# Altium schematic sheet Chargers.SchDoc
size A4
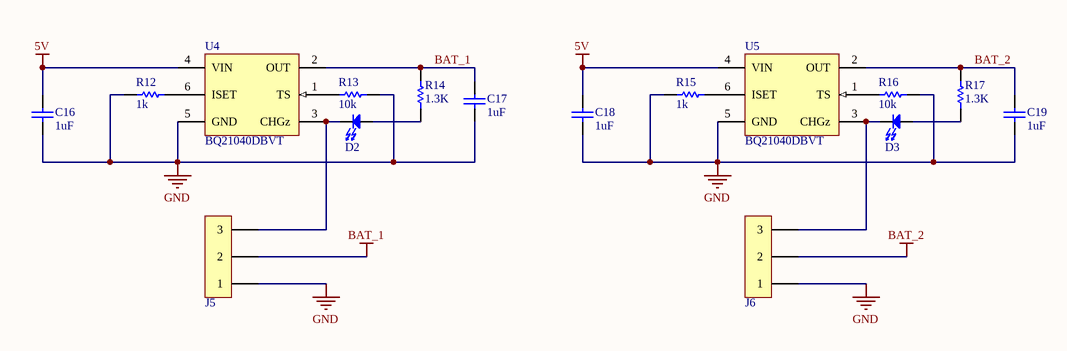
[diagram p0: Chargers.SchDoc]

## Parts
C16  1uF  [CAPC1608X09N]
C17  1uF  [CAPC1608X09N]
C18  1uF  [CAPC1608X09N]
C19  1uF  [CAPC1608X09N]
D2  LED 0603  [DIOM1608X08N]  (value not drawn)
D3  LED 0603  [DIOM1608X08N]  (value not drawn)
J5  3POS THRU HOLE 2.54MM  [3POS Through Hole 2.54MM]  (value not drawn)
J6  3POS THRU HOLE 2.54MM  [3POS Through Hole 2.54MM]  (value not drawn)
R12  1k  [RESC1608X06N]
R13  10k  [RESC1608X06N]
R14  1.3K  [RESC1608X06N]
R15  1k  [RESC1608X06N]
R16  10k  [RESC1608X06N]
R17  1.3K  [RESC1608X06N]
U4  BQ21040DBVT  [SOT95P280X145-6N (DBV)]
U5  BQ21040DBVT  [SOT95P280X145-6N (DBV)]

## Nets
5V: C16.2 C18.2 U4.4(VIN) U5.4(VIN)
BAT_1: C17.2 J5.2 R14.2 U4.2(OUT)
BAT_2: C19.2 J6.2 R17.2 U5.2(OUT)
GND: C16.1 C17.1 C18.1 C19.1 J5.1 J6.1 R12.1 R13.2 R15.1 R16.2 U4.5(GND) U5.5(GND)
NetD2_1: D2.1(K2) J5.3 U4.3(CHGz)
NetD2_2: D2.2(A2) R14.1
NetD3_1: D3.1(K2) J6.3 U5.3(CHGz)
NetD3_2: D3.2(A2) R17.1
NetR12_2: R12.2 U4.6(ISET)
NetR13_1: R13.1 U4.1(TS)
NetR15_2: R15.2 U5.6(ISET)
NetR16_1: R16.1 U5.1(TS)

## Library data of the parts
C16-C19 = CAP CER 1uF 0603: Manufacturer: Murata; Manufacturer Part Number: GRM188R7YA105KA12D; Voltage: 35V; Rating: X7R; Tolerance: 10%; Value: 1uF; Digikey Part Number: 490-10487-1-ND
D2 D3 = LED 0603: Voltage: 2.2V; Configuration: Single; Current: 20mA; Footprint: 0603; Temperature: 85dC; Digikey Part Number: 160-1447-1-ND
R12 R15 = RES 1K 0603: Manufacturer: Panasonic; Manufacturer Part Number: ERJ-PA3F1001V; Tolerance: 1%; Power: 0.25W; Type: RES; Footprint: 0603; Temperature: 155dC; Digikey Part Number: P1.0KBYCT-ND; Value: 1k
R13 R16 = RES 10K 0603: Manufacturer: Yageo; Manufacturer Part Number: RC0603FR-0710KL; Tolerance: 1%; Power: 0.1W; Type: RES; Footprint: 0603; Temperature: 155dC; Digikey Part Number: 311-10.0KHRCT-ND; Value: 10k
R14 R17 = RES 1.3K 0603: Manufacturer: Vishay Dale; Tolerance: 1%; Power: 0.1W; Type: RES; Footprint: 0603; Digikey Part Number: 541-1.30KHCT-ND; Value: 1.3K
U4 U5 = BQ21040DBVT: Charger, Li-Ion, SOT-23-6; Manufacturer: Texas Instruments; Digikey Part Number: 296-44196-1-ND; Value: BQ21040DBVT